# EAGLE schematic sec_min_subsystem (EAGLE 9.6.1)
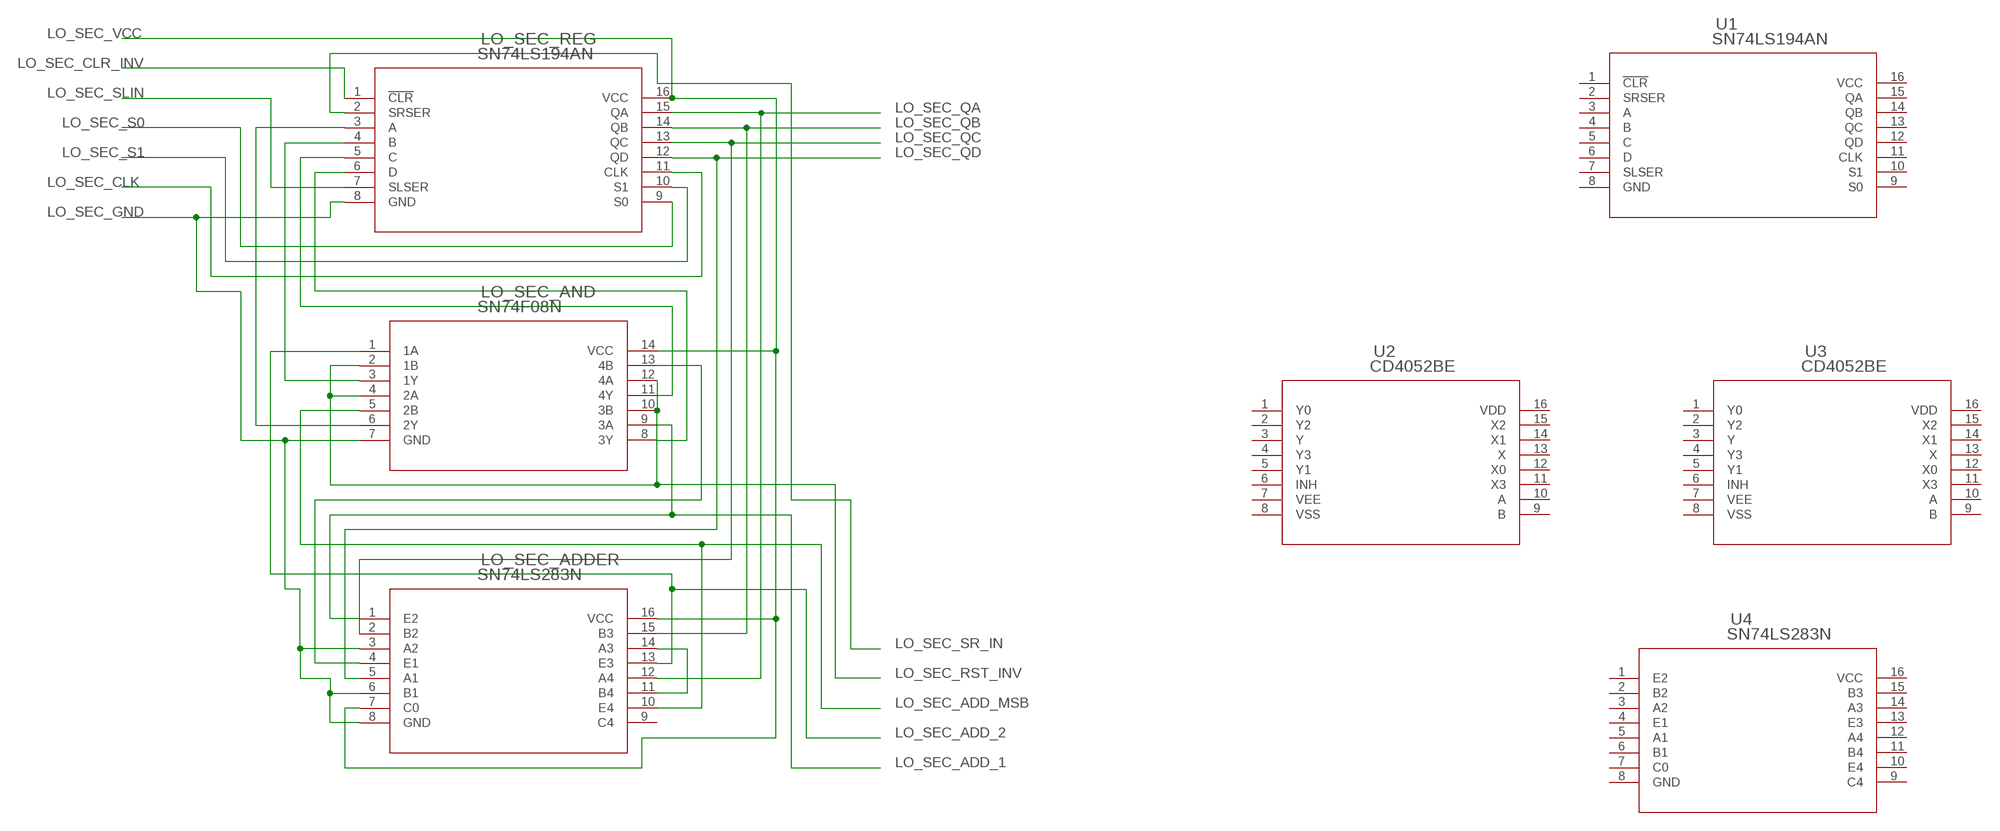
[diagram p0: schematic, sheet 1, part 1 of 2]
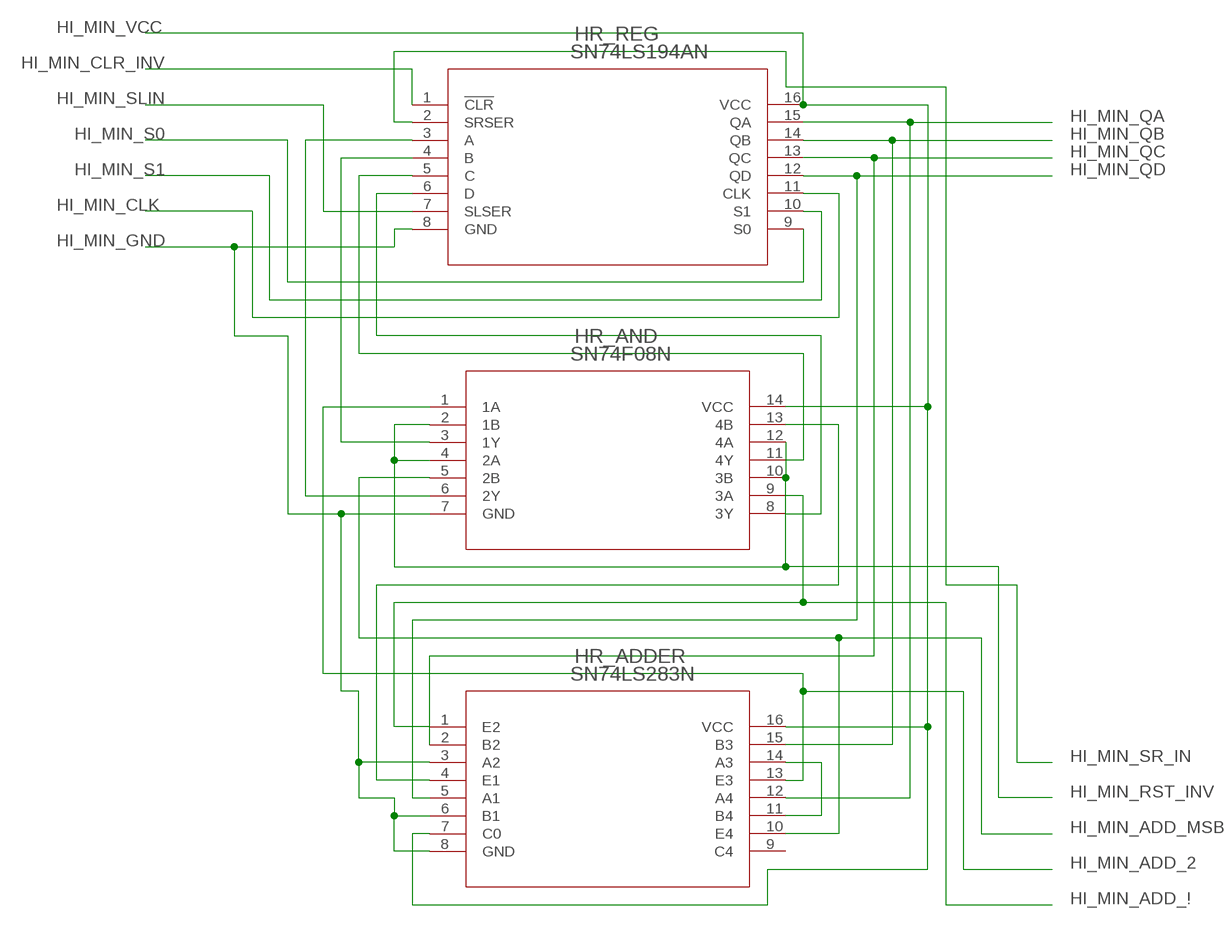
[diagram p1: schematic, sheet 1, part 2 of 2]

## Parts
HR_ADDER  SN74LS283N  [N16]
HR_AND  SN74F08N  [N14]
HR_REG  SN74LS194AN  [N16]
LO_SEC_ADDER  SN74LS283N  [N16]
LO_SEC_AND  SN74F08N  [N14]
LO_SEC_REG  SN74LS194AN  [N16]
U1  SN74LS194AN  [N16]
U2  CD4052BE  [N16]
U3  CD4052BE  [N16]
U4  SN74LS283N  [N16]

## Nets
HI_MIN_ADD_2: HR_ADDER.13(E3) HR_AND.1(1A)
HI_MIN_ADD_!: HR_ADDER.1(E2) HR_AND.9(3A)
HI_MIN_ADD_MSB: HR_ADDER.10(E4) HR_AND.5(2B)
HI_MIN_CLK: HR_REG.11(CLK)
HI_MIN_CLR_INV: HR_REG.1(!CLR)
HI_MIN_GND: HR_ADDER.3(A2) HR_ADDER.6(B1) HR_ADDER.8(GND) HR_AND.7(GND) HR_REG.8(GND)
HI_MIN_QA: HR_ADDER.12(A4) HR_REG.15(QA)
HI_MIN_QB: HR_ADDER.15(B3) HR_REG.14(QB)
HI_MIN_QC: HR_ADDER.2(B2) HR_REG.13(QC)
HI_MIN_QD: HR_ADDER.5(A1) HR_REG.12(QD)
HI_MIN_RST_INV: HR_AND.2(1B) HR_AND.4(2A) HR_AND.10(3B) HR_AND.12(4A)
HI_MIN_S0: HR_REG.9(S0)
HI_MIN_S1: HR_REG.10(S1)
HI_MIN_SLIN: HR_REG.7(SLSER)
HI_MIN_SR_IN: HR_REG.2(SRSER)
HI_MIN_VCC: HR_ADDER.7(C0) HR_ADDER.16(VCC) HR_AND.14(VCC) HR_REG.16(VCC)
LO_SEC_ADD_1: LO_SEC_ADDER.1(E2) LO_SEC_AND.9(3A)
LO_SEC_ADD_2: LO_SEC_ADDER.13(E3) LO_SEC_AND.1(1A)
LO_SEC_ADD_MSB: LO_SEC_ADDER.10(E4) LO_SEC_AND.5(2B)
LO_SEC_CLK: LO_SEC_REG.11(CLK)
LO_SEC_CLR_INV: LO_SEC_REG.1(!CLR)
LO_SEC_GND: LO_SEC_ADDER.3(A2) LO_SEC_ADDER.6(B1) LO_SEC_ADDER.8(GND) LO_SEC_AND.7(GND) LO_SEC_REG.8(GND)
LO_SEC_QA: LO_SEC_ADDER.12(A4) LO_SEC_REG.15(QA)
LO_SEC_QB: LO_SEC_ADDER.15(B3) LO_SEC_REG.14(QB)
LO_SEC_QC: LO_SEC_ADDER.2(B2) LO_SEC_REG.13(QC)
LO_SEC_QD: LO_SEC_ADDER.5(A1) LO_SEC_REG.12(QD)
LO_SEC_RST_INV: LO_SEC_AND.2(1B) LO_SEC_AND.4(2A) LO_SEC_AND.10(3B) LO_SEC_AND.12(4A)
LO_SEC_S0: LO_SEC_REG.9(S0)
LO_SEC_S1: LO_SEC_REG.10(S1)
LO_SEC_SLIN: LO_SEC_REG.7(SLSER)
LO_SEC_SR_IN: LO_SEC_REG.2(SRSER)
LO_SEC_VCC: LO_SEC_ADDER.7(C0) LO_SEC_ADDER.16(VCC) LO_SEC_AND.14(VCC) LO_SEC_REG.16(VCC)
N$1: LO_SEC_AND.6(2Y) LO_SEC_REG.3(A)
N$2: LO_SEC_AND.3(1Y) LO_SEC_REG.4(B)
N$3: LO_SEC_AND.11(4Y) LO_SEC_REG.5(C)
N$4: LO_SEC_AND.8(3Y) LO_SEC_REG.6(D)
N$5: LO_SEC_ADDER.4(E1) LO_SEC_AND.13(4B)
N$6: HR_AND.6(2Y) HR_REG.3(A)
N$7: HR_AND.3(1Y) HR_REG.4(B)
N$8: HR_AND.11(4Y) HR_REG.5(C)
N$9: HR_AND.8(3Y) HR_REG.6(D)
N$10: HR_ADDER.4(E1) HR_AND.13(4B)
N$11: HR_ADDER.11(B4) HR_ADDER.14(A3)
N$14: LO_SEC_ADDER.11(B4) LO_SEC_ADDER.14(A3)
Unconnected: HR_ADDER.9(C4) LO_SEC_ADDER.9(C4) U1.1(!CLR) U1.2(SRSER) U1.3(A) U1.4(B) U1.5(C) U1.6(D) U1.7(SLSER) U1.9(S0) U1.10(S1) U1.11(CLK) U1.12(QD) U1.13(QC) U1.14(QB) U1.15(QA) U2.1(Y0) U2.2(Y2) U2.3(Y) U2.4(Y3) U2.5(Y1) U2.6(INH) U2.9(B) U2.10(A) U2.11(X3) U2.12(X0) U2.13(X) U2.14(X1) U2.15(X2) U3.1(Y0) U3.2(Y2) U3.3(Y) U3.4(Y3) U3.5(Y1) U3.6(INH) U3.9(B) U3.10(A) U3.11(X3) U3.12(X0) U3.13(X) U3.14(X1) U3.15(X2) U4.1(E2) U4.2(B2) U4.3(A2) U4.4(E1) U4.5(A1) U4.6(B1) U4.7(C0) U4.9(C4) U4.10(E4) U4.11(B4) U4.12(A4) U4.13(E3) U4.14(A3) U4.15(B3)

## Power pins joined to a net without a drawn wire
GND: U1.8(GND) U4.8(GND)
VCC: U1.16(VCC) U4.16(VCC)
VDD: U2.16(VDD) U3.16(VDD)
VEE: U2.7(VEE) U3.7(VEE)
VSS: U2.8(VSS) U3.8(VSS)

## Library data of the parts
HR_ADDER LO_SEC_ADDER U4 = sn74ls283n:SN74LS283N: 4-Bit Full Adder w/ Fast Carry; DATASHEET_URL: http://www.ti.com/lit/gpn/SN74LS283; DESCRIPTION: 4-Bit Binary Full Adders With Fast Carry; FAMILY_NAME: ADDER; GENERIC_PART_NUMBER: SN74LS283; INDUSTRY_STD_PKG_TYPE: PDIP; MANUFACTURER: Texas Instruments; PACKAGE_DESIGNATOR: N; PIN_COUNT: 16
HR_AND LO_SEC_AND = sn74f08n:SN74F08N: Quad 2-In Positive AND; DATASHEET_URL: http://www.ti.com/lit/gpn/SN74F08; DESCRIPTION: Quadruple 2-Input Positive-AND Gate; FAMILY_NAME: AND GATE; GENERIC_PART_NUMBER: SN74F08; INDUSTRY_STD_PKG_TYPE: PDIP; MANUFACTURER: Texas Instruments; PACKAGE_DESIGNATOR: N; PIN_COUNT: 14
HR_REG LO_SEC_REG U1 = sn74ls194an:SN74LS194AN: 4-Bit BiDir. Universal Shift Register; DATASHEET_URL: http://www.ti.com/lit/gpn/SN74LS194A; DESCRIPTION: Bidirectional universal shift registers; FAMILY_NAME: SHIFT REGISTER; GENERIC_PART_NUMBER: SN74LS194A; INDUSTRY_STD_PKG_TYPE: PDIP; MANUFACTURER: Texas Instruments; PACKAGE_DESIGNATOR: N; PIN_COUNT: 16
U2 U3 = cd4052be:CD4052BE: 4:1 Dual-Channel General MUX; DATASHEET_URL: http://www.ti.com/lit/gpn/CD4052B; DESCRIPTION: CMOS Differential 4-Channel Analog Multiplexer/Demultiplexer with Logic-Level Conversion; FAMILY_NAME: ANALOG SWITCH/MULTIPLEXER (greater than 5V); GENERIC_PART_NUMBER: CD4052B; INDUSTRY_STD_PKG_TYPE: PDIP; MANUFACTURER: Texas Instruments; PACKAGE_DESIGNATOR: N; PIN_COUNT: 16